# Altium schematic sheet BATTERY-CONTROL.SchDoc
size B
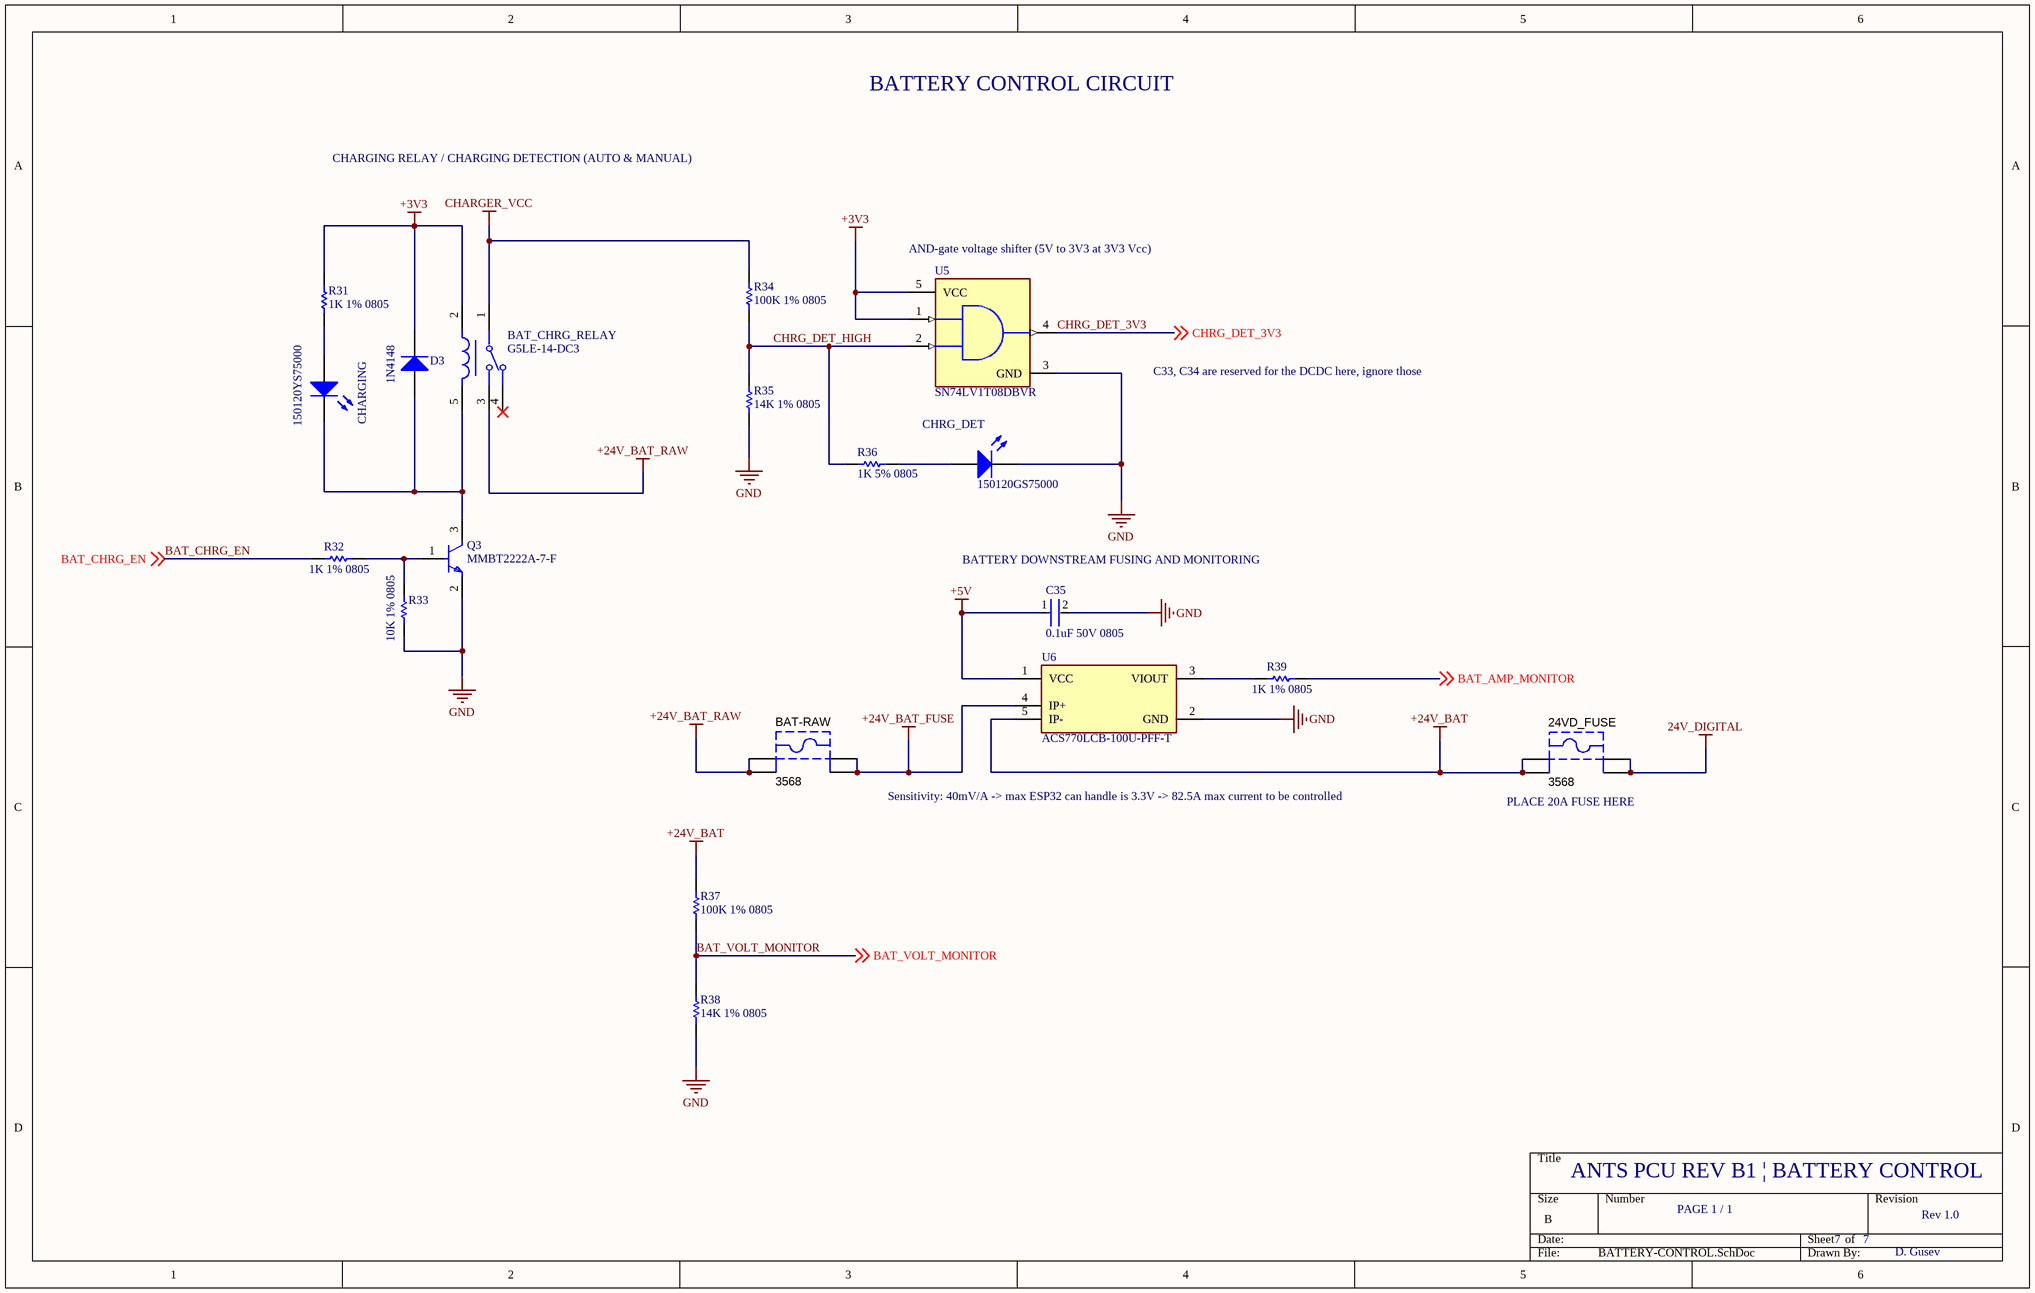
[diagram p0: BATTERY-CONTROL.SchDoc]

## Parts
24VD_FUSE  3568  [KSTN-3568_V]
BAT-RAW  3568  [KSTN-3568_V]
BAT_CHRG_RELAY  G5LE-14-DC3  [FP-G5LE-14-DC5-MFG]
C35  0.1uF 50V 0805  [FP-C0805C-DN-MFG]
CHARGING  150120YS75000  [1206_A]
CHRG_DET  150120GS75000  [1206_A]
D3  1N4148  [NXP-SOD27-2_V]
Q3  MMBT2222A-7-F  [FP-SOT23-IPC_A]
R31  1K 1% 0805  [RESC2013X60X35ML10T20]
R32  1K 1% 0805  [RESC2013X60X35ML10T20]
R33  10K 1% 0805  [RESC2013X60X35NL10T20]
R34  100K 1% 0805  [RESC2013X60X35ML10T20]
R35  14K 1% 0805  [RESC2013X60X35LL10T20]
R36  1K 5% 0805  [RESC2013X60X40ML20T25]
R37  100K 1% 0805  [RESC2013X60X35ML10T20]
R38  14K 1% 0805  [RESC2013X60X35LL10T20]
R39  1K 1% 0805  [RESC2013X60X35ML10T20]
U5  SN74LV1T08DBVR  [FP-DBV0005A-IPC_B]
U6  ACS770LCB-100U-PFF-T  [ACS770LCB-100U-PFF-T]

## Nets
24V_DIGITAL: 24VD_FUSE.3 24VD_FUSE.4
+3V3: BAT_CHRG_RELAY.2 D3.2(K) R31.1 U5.1(A) U5.5(VCC)
+5V: C35.1 U6.1(VCC)
+24V_BAT: 24VD_FUSE.1 24VD_FUSE.2 R37.2 U6.5(IP-)
+24V_BAT_FUSE: BAT-RAW.1 BAT-RAW.2 U6.4(IP+)
+24V_BAT_RAW: BAT-RAW.3 BAT-RAW.4 BAT_CHRG_RELAY.3
CHARGER_VCC: BAT_CHRG_RELAY.1 R34.2
GND: C35.2 CHRG_DET.1(K) Q3.2(E) R33.1 R35.1 R38.1 U5.3(GND) U6.2(GND)
BAT_AMP_MONITOR: R39.2 ; off-sheet BAT_AMP_MONITOR
BAT_CHRG_EN: R32.1 ; off-sheet BAT_CHRG_EN
BAT_VOLT_MONITOR: R37.1 R38.2 ; off-sheet BAT_VOLT_MONITOR
CHRG_DET_3V3: U5.4(Y) ; off-sheet CHRG_DET_3V3
CHRG_DET_HIGH: R34.1 R35.2 R36.2 U5.2(B)
NetBAT_CHRG_RELAY_5: BAT_CHRG_RELAY.5 CHARGING.1(K) D3.1(A) Q3.3(C)
NetCHARGING_2: CHARGING.2(A) R31.2
NetCHRG_DET_2: CHRG_DET.2(A) R36.1
NetQ3_1: Q3.1(B) R32.2 R33.2
NetR39_1: R39.1 U6.3(VIOUT)

Not connected (* = marked no-connect by the designer): BAT_CHRG_RELAY 4*

## Notes on the sheet
- BATTERY CONTROL CIRCUIT
- CHARGING RELAY / CHARGING DETECTION (AUTO & MANUAL)
- (near U5) AND-gate voltage shifter (5V to 3V3 at 3V3 Vcc)
- C33, C34 are reserved for the DCDC here, ignore those
- (near C35) BATTERY DOWNSTREAM FUSING AND MONITORING
- Sensitivity: 40mV/A -> max ESP32 can handle is 3.3V -> 82.5A max current to be controlled
- (near 24VD_FUSE) PLACE 20A FUSE HERE
- ANTS PCU REV B1 | BATTERY CONTROL
- PAGE 1 / 1
- 7
- Rev 1.0
- D. Gusev

## Library data of the parts
24VD_FUSE BAT-RAW = CMP-2000-05464-1: Fuse Holder, 20 A, 500 V, -50 to 145 degC, 4-Pin THD, RoHS; Manufacturer: Keystone; Package Reference: 3568; Datasheet Version: 04/2013; Datasheet URL: https://datasheet.ciiva.com/16294/m60-2p40-16294706.pdf; Manufacturer URL: http://www.keyelco.com/; Mounting Technology: ThroughHole; Package Description: 4-Pin Through Hole Device, Body 16 x 6.73 mm, Pitch 9.9 mm
BAT_CHRG_RELAY = CMP-08822-000008-1: RELAY GEN PURPOSE SPDT 10A 5V; Manufacturer: Omron; Manufacturer Part Number: G5LE-14-DC5; Number Of Contacts: 1; Coil Type: Non-Latching; Coil Current: 79.4mA; Coil Power: 400mW; Coil Resistance: 63Ω; Standoff Height: 0.5mm; Throw Configuration: SPDT; Ambient Temperature Range Low: -25°C; Package: 0; Device Class L2: Relays; Temperature Range High: +85°C; ComponentLink2Description: Datasheet; Octopart: https://octopart.com/g5le-14-dc5-omron-28829; Coil Voltage: 5V; Lead Free: Yes; Digikey Description: RELAY GEN PURPOSE SPDT 10A 5V; Device Class L1: Electromechanical; Device Class L3: Power Relays; ComponentLink2URL: https://omronfs.omron.com/en_US/ecb/products/pdf/en-g5le.pdf; Temperature: -25°C to +85°C; Ambient Temperature Range High: +85°C; RoHS: TRUE; Automotive: No; Height: 19mm; Category: Relay; Mouser Description: General Purpose Relays Power PCB Relay SPDT Sealed 5VDC; Current Rating: 10A; Switching Current: 10A; Temperature Range Low: -25°C
C35 = CMP-2007-00279-2: CAP CER 0.1UF 50V X7R 0805; Manufacturer Part Number: C0805C104K5RACTU; Manufacturer: KEMET; Value: 0.10 μF; Tolerance: 0.1; Temperature Coefficient: 30ppm/°C; Material: Ceramic; Device Class L2: Capacitors; Temperature Range Low: -55°C; Voltage Rating: 50 V; Digikey Description: CAP CER 0.1UF 50V X7R 0805; Category: Cap; ComponentLink2Description: Datasheet; Octopart: https://octopart.com/c0805c104k5ractu-kemet-143926; RoHS: TRUE; ComponentLink2URL: https://content.kemet.com/datasheets/KEM_C1003_C0G_SMD.pdf; Temperature Characteristic: X7R; Temperature: -55°C to +125°C; Height: 0.88mm; Temperature Range High: +125°C; Device Class L1: Passive Components; Automotive: No; Lead Free: Yes; Ipc Land Pattern Name: CAPC200125X78; Device Class L3: Ceramic Capacitors; Mouser Description: Cap Ceramic 0.1uF 50V X7R 10% SMD 2.0 x 1.2 mm 125 C Paper T/R; Capacitance: 0.10 μF; Package: C0805C-DN
CHARGING = CMP-1426-00019-1: SMD mono-color Chip LED, WL-SMCW, Yellow; Manufacturer: Wuerth Elektronik; ComponentLink2URL: http://katalog.we-online.com/led/datasheet/150120YS75000.pdf; PartNumber: 150120YS75000; ComponentLink1URL: http://www.we-online.com; Color: Yellow; ComponentLink1Description: Manufacturer URL; PackageReference: 1206_A; ComponentLink2Description: Datasheet
CHRG_DET = CMP-1426-00014-1: SMD mono-color Chip LED, WL-SMCW, Green; Manufacturer: Wuerth Elektronik; PackageReference: 1206_A; PartNumber: 150120GS75000; ComponentLink1Description: Manufacturer URL; ComponentLink2URL: http://katalog.we-online.com/led/datasheet/150120GS75000.pdf; ComponentLink2Description: Datasheet; Color: Green; ComponentLink1URL: http://www.we-online.com
D3 = CMP-0648-00002-1: High-speed Diode, 100 V, 450 mA, 2-Pin SOD27, RoHS; Manufacturer: NXP Semiconductors; Configuration: Single; IR (VR: 20 V)=25 nA; IFRM: 450 mA; IFSM: 4 A Max.; Trr: 4 ns Max.; Cd: 4 pF Max.; VR: 100 V Max.; VF (IF: 10 mA)=1 V; IF: 200 mA Max.; ComponentLink1Description: Manufacturer URL; RoHS: TRUE; ComponentLink1URL: http://www.nxp.com/; ComponentLink3Description: Package Specification; DatasheetVersion: Aug-04; ComponentLink2Description: Datasheet; PackageVersion: Aug-04; PackageReference: SOD27; ComponentLink3URL: http://www.nxp.com/documents/data_sheet/1N4148_1N4448.pdf; Mounting Technology: Through Hole; ComponentLink2URL: http://www.nxp.com/documents/data_sheet/1N4148_1N4448.pdf; PartNumber: 1N4148; PackageDescription: 2-Pin Hermetically Sealed Glass Package, Axial Leaded, Dia 1.85 mm, Body Length 4.25 mm, Lead Spread 25.4 mm
Q3 = CMP-12798-000050-1: TRANS NPN 40V 0.6A SMD SOT23-3; Number of Elements: 1; Frequency: 300MHz; Max Collector Current: 600mA; Collector Base Voltage (VCBO): 75V; Current: 1A; Element Configuration: Single; Power Dissipation: 350mW; hFE Min: 100; Collector Emitter Saturation Voltage: 1V; Max Power Dissipation: 300mW; Emitter Base Voltage (VEBO): 6V; Voltage: 40V; Collector Emitter Breakdown Voltage: 40V; Width: 1.4mm; Polarity: NPN; Termination: SMD/SMT; Max Operating Temperature: 150°C; Transition Frequency: 300MHz; Contact Plating: Tin; Mount: Surface Mount; Max Frequency: 300MHz; Case/Package: SOT-23; Gain Bandwidth Product: 300MHz; Lead Free: Lead Free; Collector Emitter Voltage (VCEO): 40V; Radiation Hardening: No; Voltage Rating (DC): 40V; Height: 1mm; Max Breakdown Voltage: 40V; Packaging: Tape and Reel; Length: 3.05mm; Min Operating Temperature: -55°C; Weight: 0.000282oz; Current Rating: 600mA; REACH SVHC: No SVHC; Package Quantity: 3000; Continuous Collector Current: 600mA; Number of Pins: 3
R31 R32 R39 = CMP-2100-03671-1: Chip Resistor, 1 KOhm, +/- 1%, 125 mW, -55 to 155 degC, 0805 (2012 Metric), RoHS, Tape and Reel; Manufacturer: Yageo; Temperature Coefficient: 100ppm/degreesC; Voltage Rating (DC): 150V; Max Power Dissipation: 125mW; Resistance: 1KOhm; Number of Pins: 2; Number of Terminations: 2; Datasheet URL: http://www.yageo.com/NewPortal/yageodocoutput?fileName=/pdf/R-Chip/PYu-RC_Group_51_RoHS_L_5.pdf; Length: 0.079inch; Package Description: 2-Pin Surface Mounted Device, Body 2 x 1.25 mm; Depth: 1.25mm; Height: 0.024inch; Military Standard: Not; Case/Package: 0805; Package Reference: 0805; RoHSCompliant: true; Lead Free: LeadFree; Packaging: TapeandReel; Package Quantity: 1; Datasheet Version: Rev. 5, 10/2016; Tolerance: 1%; Min Operating Temperature: -55degC; Voltage Rating: 150V; Composition: ThickFilm; Case Code (Imperial): 0805; Power Rating: 125mW; Width: 0.049inch; Case Code (Metric): 2012; Manufacturer URL: http://www.yageo.com/; Max Operating Temperature: 155degC; REACH SVHC: Unknown; Termination: SMD/SMT
R33 = CMP-1659-00013-4: Chip Resistor, 10 KOhm, +/- 1%, 0.125 W, -55 to 155 degC, 0805 (2012 Metric), RoHS, Tape and Reel; Manufacturer: Yageo; Voltage Rating: 150 V; Mount: Surface Mount; ComponentLink1Description: Manufacturer URL; ComponentLink2URL: http://www.yageo.com/documents/recent/PYu-RC_Group_51_RoHS_L_04.pdf; Pins: 2; Length: 2 mm; Min Operating Temperature: -55 degC; Height: 0.5 mm; Mounting Technology: Surface Mount; RoHSCompliant: true; REACH SVHC: No SVHC; ComponentLink1URL: http://www.yageo.com/; Max Operating Temperature: 155 degC; PackageReference: 0805; DatasheetVersion: Rev. 4, 02/2016; Package Quantity: 5000; Packaging: Tape and Reel; ComponentLink2Description: Datasheet; PackageDescription: 2-Pin Surface Mounted Device, Body 2 x 1.25 mm
R34 R37 = CMP-2100-03668-1: Chip Resistor, 100 KOhm, +/- 1%, 0.125 W, -55 to 155 degC, 0805 (2012 Metric), RoHS, Tape and Reel; Manufacturer: Yageo; Max Power Dissipation: 125mW; Voltage Rating: 150V; Temperature Coefficient: 100ppm/degreesC; Manufacturer URL: http://www.yageo.com/; Min Operating Temperature: -55degC; Lead Pitch: 0.4mm; Composition: ThickFilm; Case Code (Metric): 2012; Military Standard: Not; Package Description: 2-Pin Surface Mounted Device, Body 2 x 1.25 mm; REACH SVHC: Unknown; RoHSCompliant: true; Depth: 1.25mm; Number of Pins: 2; Lead Free: LeadFree; Resistance: 100KOhm; Datasheet URL: http://www.yageo.com/NewPortal/yageodocoutput?fileName=/pdf/R-Chip/PYu-RC_Group_51_RoHS_L_5.pdf; Max Operating Temperature: 155degC; Case/Package: 0805; Package Quantity: 1; Case Code (Imperial): 0805; Power Rating: 125mW; Width: 0.049inch; Package Reference: 0805; Height: 0.024inch; Termination: SMD/SMT; Tolerance: 1%; Datasheet Version: Rev. 5, 10/2016; Length: 2mm; Voltage Rating (DC): 150V; Number of Terminations: 2; Packaging: TapeandReel
R35 R38 = CMP-1013-00638-2: Part Number: RC0805FR-0714KL; Manufacturer: Yageo
R36 = CMP-2001-00590-1: Part Number: ERA6AEB123V; Manufacturer: Panasonic
U5 = CMP-0859-00119-4: IC GATE AND 1CH 2-INP SOT23-5; Quiescent Current: 1uA; Logic Function: AND GATE; Number of Inputs: 2; Number of Circuits: 1; Min Supply Voltage: 1.6V; High Level Output Current: -8mA; Max Supply Voltage: 5.5V; Low Level Output Current: 8mA; Propagation Delay: 7ns; Packaging: Tape and Reel; Number of Pins: 5; Min Operating Temperature: -40°C; Radiation Hardening: No; Package Quantity: 3000; Weight: 0.000557oz; Height: 1.45mm; RoHS Compliant: Yes; Length: 3.05mm; Number of Bits: 1; Width: 1.75mm; Number of Gates: 1; Max Operating Temperature: 125°C; Mount: Surface Mount; Case/Package: SOT-23-5; Lead Free: Lead Free; Number of Input Lines: 2
U6 = ACS770LCB-100U-PFF-T: SENSOR CURRENT HALL 100A DC; Min Input Voltage: 4.5V; Polarity: Unidirectional; Quiescent Current: 10mA; Bandwidth: 120kHz; Max Input Voltage: 5.5V; Sensitivity: 40mV/A; Accuracy: 0.6%; Response Time: 4.6us; Max Supply Current: 15mA; Linearity: 1%; Number of Channels: 1; Max Operating Temperature: 150°C; Package Quantity: 34; Min Operating Temperature: -40°C; Packaging: Rail/Tube; Number of Pins: 5; Width: 13mm; Height: 7mm; Current Sensing: 100A; Length: 14mm; Frequency: 120kHz; Mount: Through Hole